# Altium schematic sheet POWER.SchDoc
size A4; SheetNumber: 3; SheetTotal: 8
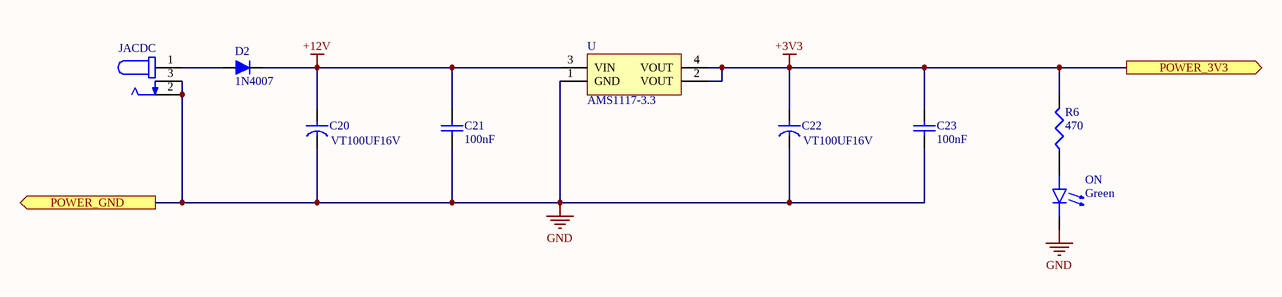
[diagram p0: POWER.SchDoc]

## Parts
C20  VT100UF16V  [SMD,D6.3xL5.4mm]
C21  100nF  [CAPC0805(2012)145_L]
C22  VT100UF16V  [SMD,D6.3xL5.4mm]
C23  100nF  [CAPC0805(2012)145_L]
D2  1N4007  [1N4007]
JACDC  DCJ200-10-A-XX-K_REVA  [GCT_DCJ200-10-A-XX-K_REVA]  (value not drawn)
ON  Green  [0805 (2012 Metric) Green]
R6  value 470  [0805 (2012 Metric)]  (hidden comment: 220)
U  AMS1117-3.3  [SOT229P700X180-4N]

## Ports
POWER_3V3 (out), POWER_GND (out)

## Nets
+3V3: C22.1 C23.2 R6.2 U.2(VOUT) U.4(VOUT) ; port POWER_3V3
+12V: C20.1 C21.2 D2.1 U.3(VIN)
GND: C20.2 C21.1 C22.2 C23.1 JACDC.2 JACDC.3 ON.1(K) U.1(GND) ; port POWER_GND
NetD2_2: D2.2 JACDC.1
NetON_2: ON.2(A) R6.1

## Library data of the parts
C20 C22 = CMP-001-00092-1: 100uF 16V 60mA@120Hz ±20% SMD,D6.3xL5.4mm  Aluminum Electrolytic Capacitors - SMD ROHS; JLCPCB Part #: C5246579; ComponentLink1Description: DigiKey; ComponentLink2Description: thegioiic
C21 C23 = CMP-001-00081-5: Chip Capacitor, 100nF +/-40%, 16V, 0805, Thickness 1.45 mm; Tolerance: 5%; Min Operating Temperature: -55°C; Case/Package: 0805; Pins: 2; Max Operating Temperature: 85°C; Voltage Rating: 16V; Mounting Technology: SMT; Value: 100nF
D2 = CMP-004-00031-1: Design Item ID: diode; Source: components.SchLib; JLCPCB Part #: C95872
JACDC = CMP-002-00071-1: Power Barrel Connector Jack 2.05mm ID (0.081), 5.50mm OD (0.217) Through Hole, Right Angle; MP: DCJ200-10-A-K1-K; MF: Global Connector Technology; Value: *; Design Item ID: DCJ200-10-A-XX-K_REVA; Check_prices: https://www.snapeda.com/parts/DCJ200-10-A-K1-K/Global+Connector+Technology/view-part/?ref=eda; Component Type: Standard; Case/Package: None; Pins: 3; SnapEDA_Link: https://www.snapeda.com/parts/DCJ200-10-A-K1-K/Global+Connector+Technology/view-part/?ref=snap; Source: DCJ200-10-A-XX-K_REVA.SchLib
ON = CMP-007-00046-3: Oreki; JLCPCB Part #: C389524; ComponentLink1Description: DigiKey
R6 = CMP-009-00179-13: Oreki; ComponentLink1Description: DigiKey; RoHS Compliant: Yes; Mounting Technology: SMT; Pins: 2; Case/Package: Chip
U = CMP-019-00049-4: Oreki; ComponentLink2Description: thegioiic; ComponentLink1Description: DigiKey; JLCPCB Part #: C6186